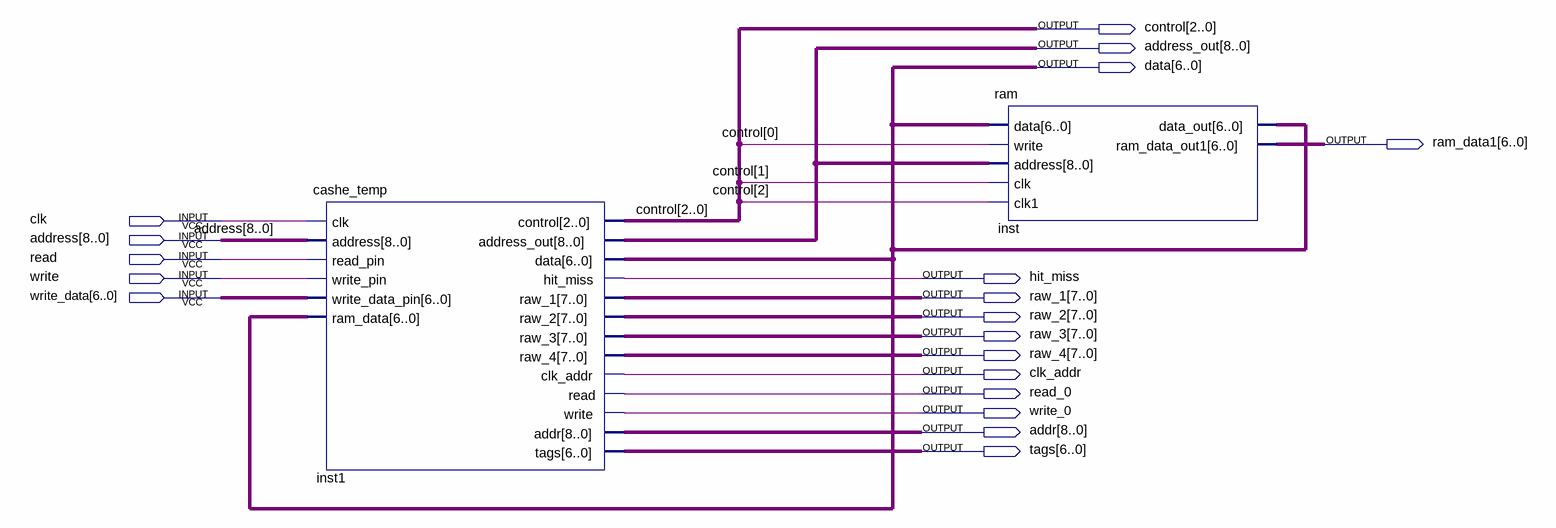
[diagram p0: schematic sheet]
// Quartus schematic lab_6.bdf as structural Verilog: 2 symbols, 19 pins
module lab_6 (
  input  clk,
  input  [8:0] address,
  input  read,
  input  write,
  input  [6:0] write_data,
  output [2:0] control,
  output [8:0] address_out,
  output [6:0] data,
  output [6:0] ram_data1,
  output hit_miss,
  output [7:0] raw_1,
  output [7:0] raw_2,
  output [7:0] raw_3,
  output [7:0] raw_4,
  output clk_addr,
  output read_0,
  output write_0,
  output [8:0] addr,
  output [6:0] tags
);

  cashe_temp inst1 (
    .clk(clk), .address(address), .read_pin(read), .write_pin(write), .write_data_pin(write_data),
    .ram_data(data), .control(control), .address_out(address_out), .data(data), .hit_miss(hit_miss),
    .raw_1(raw_1), .raw_2(raw_2), .raw_3(raw_3), .raw_4(raw_4), .clk_addr(clk_addr), .read(read_0),
    .write(write_0), .addr(addr), .tags(tags));
  ram inst (
    .data(data), .write(control[0]), .address(address_out), .clk(control[1]), .clk1(control[2]),
    .data_out(data), .ram_data_out1(ram_data1));
endmodule
